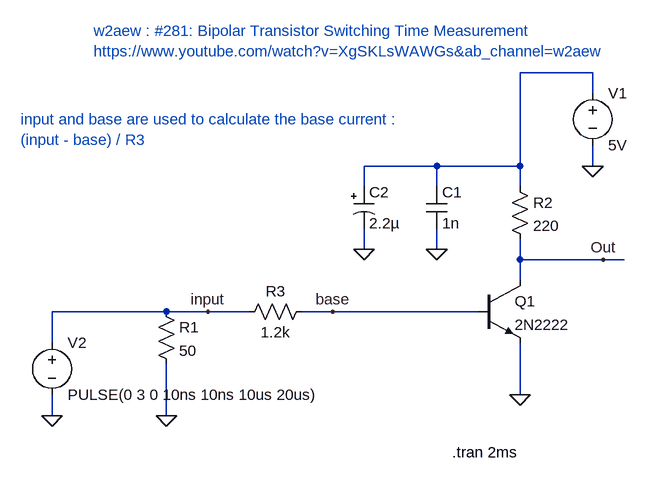
[diagram p0: schematic BJTSwitchingTimeMeasurement.asc]
BJTSwitchingTimeMeasurement.asc, the LTspice schematic file:
Version 4
SHEET 1 880 680
WIRE 736 -208 624 -208
WIRE 736 -176 736 -208
WIRE 496 -64 384 -64
WIRE 624 -64 624 -208
WIRE 624 -64 496 -64
WIRE 736 -64 736 -96
WIRE 384 -32 384 -64
WIRE 496 -32 496 -64
WIRE 624 -32 624 -64
WIRE 384 64 384 32
WIRE 496 64 496 32
WIRE 624 80 624 48
WIRE 752 80 624 80
WIRE 784 80 752 80
WIRE 624 112 624 80
WIRE 80 160 -96 160
WIRE 144 160 80 160
WIRE 208 160 144 160
WIRE 336 160 288 160
WIRE 560 160 336 160
WIRE -96 208 -96 160
WIRE 624 288 624 208
WIRE -96 320 -96 288
WIRE 80 320 80 240
FLAG 624 288 0
FLAG -96 320 0
FLAG 80 320 0
FLAG 736 -64 0
FLAG 496 64 0
FLAG 384 64 0
FLAG 144 160 input
FLAG 336 160 base
FLAG 752 80 Out
SYMBOL voltage 736 -192 R0
WINDOW 123 0 0 Left 0
WINDOW 39 0 0 Left 0
SYMATTR InstName V1
SYMATTR Value 5V
SYMBOL voltage -96 192 R0
WINDOW 123 0 0 Left 0
WINDOW 39 0 0 Left 0
SYMATTR InstName V2
SYMATTR Value PULSE(0 3 0 10ns 10ns 10us 20us)
SYMBOL res 64 144 R0
SYMATTR InstName R1
SYMATTR Value 50
SYMBOL res 608 -48 R0
SYMATTR InstName R2
SYMATTR Value 220
SYMBOL res 304 144 R90
WINDOW 0 0 56 VBottom 2
WINDOW 3 32 56 VTop 2
SYMATTR InstName R3
SYMATTR Value 1.2k
SYMBOL cap 480 -32 R0
SYMATTR InstName C1
SYMATTR Value 1n
SYMBOL polcap 368 -32 R0
WINDOW 3 24 56 Left 2
SYMATTR Value 2.2µ
SYMATTR InstName C2
SYMATTR Description Capacitor
SYMATTR Type cap
SYMATTR SpiceLine V=35 Irms=8.4m Rser=1.5 Lser=550f mfg="Würth Elektronik" pn="865250540001 WCAP-ASNP 4.3x4.3" type="Al electrolytic"
SYMBOL npn 560 112 R0
SYMATTR InstName Q1
SYMATTR Value 2N2222
TEXT -32 -272 Left 2 ;w2aew : #281: Bipolar Transistor Switching Time Measurement\nhttps://www.youtube.com/watch?v=XgSKLsWAWGs&ab_channel=w2aew
TEXT -144 -136 Left 2 ;input and base are used to calculate the base current :\n(input - base) / R3
TEXT 520 376 Left 2 !.tran 2ms

The netlist it stands for:
* BJTSwitchingTimeMeasurement.asc
V1 N001 0 5V
V2 input 0 PULSE(0 3 0 10ns 10ns 10us 20us)
R1 input 0 50
R2 N001 Out 220
R3 base input 1.2k
C1 N001 0 1n
C2 N001 0 2.2µ V=35 Irms=8.4m Rser=1.5 Lser=550f mfg="Würth Elektronik" pn="865250540001 WCAP-ASNP 4.3x4.3" type="Al electrolytic"
Q1 Out base 0 0 2N2222
.model NPN NPN
.model PNP PNP
.lib standard.bjt
* w2aew : #281: Bipolar Transistor Switching Time Measurement
* https://www.youtube.com/watch?v=XgSKLsWAWGs&ab_channel=w2aew
* input and base are used to calculate the base current :
* (input - base) / R3
.tran 2ms
.backanno
.end